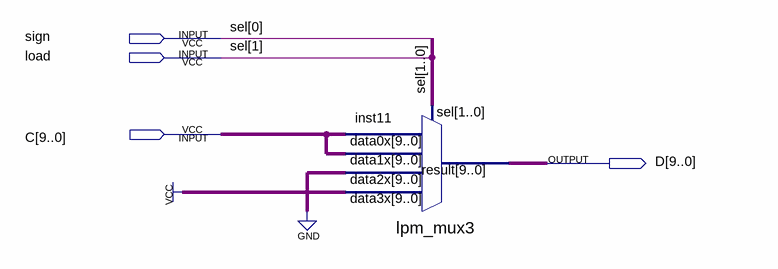
[diagram p0: schematic sheet]
// Quartus schematic muxCor1.bdf as structural Verilog: 1 symbols, 4 pins
module muxCor1 (
  input  sign,
  input  load,
  input  [9:0] C,
  output [9:0] D
);

  lpm_mux3 inst11 (.data3x({10{1'b1}}), .data2x({10{1'b0}}), .data1x(C), .data0x(C), .sel({load, sign}), .result(D));

  // Other names for the same wires on the sheet: sel[1:0] = {load, sign}
endmodule
